# Altium schematic sheet AD637.SchDoc
size A4
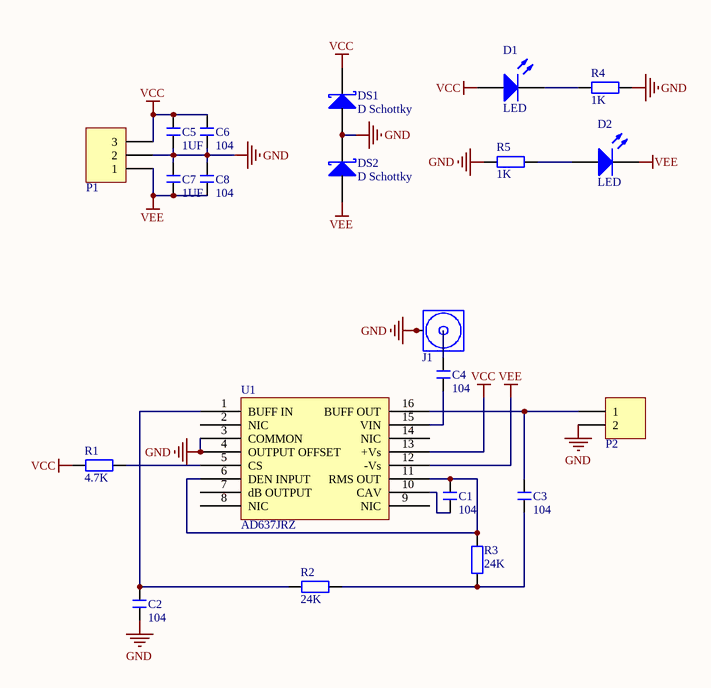
[diagram p0: AD637.SchDoc]

## Parts
C1  104  [C 0805]
C2  104  [C 1206]
C3  104  [C 1206]
C4  104  [C 0805]
C5  1UF  [C 0805]
C6  104  [C 0805]
C7  1UF  [C 0805]
C8  104  [C 0805]
D1  LED  [LED_0805]
D2  LED  [LED_0805]
DS1  D Schottky  [DIODE-SMA]
DS2  D Schottky  [DIODE-SMA]
J1  COAX  [MCX5.08-5-H]  (value not drawn)
P1  Header 3  [HDR3X1_B2]  (value not drawn)
P2  Header 2  [HDR2X1_B2]  (value not drawn)
R1  4.7K  [R 0603]
R2  24K  [R 0603]
R3  24K  [R 0603]
R4  1K  [R 0805]
R5  1K  [R 0805]
U1  AD637JRZ  [RW_16_M]

## Nets
GND: C2.2 C5.2 C6.2 C7.1 C8.1 DS1.1 DS2.2 J1.2(GND) J1.3(GND) J1.4(GND) J1.5(GND) P1.2 P2.2 R4.2 R5.1 U1.3(COMMON) U1.4(OUTPUT_OFFSET)
VCC: C5.1 C6.1 D1.1(A) DS1.2 P1.3 R1.1 U1.13(+Vs)
VEE: C7.2 C8.2 D2.2(K) DS2.1 P1.1 U1.12(-Vs)
NetC1_1: C1.1 U1.10(CAV)
NetC1_2: C1.2 R3.2 U1.6(DEN_INPUT) U1.11(RMS_OUT)
NetC2_1: C2.1 R2.1 U1.1(BUFF_IN)
NetC3_1: C3.1 P2.1 U1.16(BUFF_OUT)
NetC3_2: C3.2 R2.2 R3.1
NetC4_1: C4.1 J1.1(Signal)
NetC4_2: C4.2 U1.15(VIN)
NetD1_2: D1.2(K) R4.1
NetD2_1: D2.1(A) R5.2
NetR1_2: R1.2 U1.5(CS)

Not connected (* = marked no-connect by the designer): U1 2(NIC) 7(dB_OUTPUT) 8(NIC) 9(NIC) 14(NIC)

## Library data of the parts
C1-C8 = C: 无极性贴片电容; 版权归属: 源创客; BOM名称: 无极性贴片电容; 学习资源: www.ooocke.com
D1 D2 = LED: 发光二极管; Published: 8-Jun-2000; LatestRevisionDate: 08-Jul-2005; LatestRevisionNote: Mech Layer 1 removed.; PackageReference: LED; Publisher: Altium Limited
DS1 DS2 = D Schottky: Schottky Diode; Published: 8-Jun-2000; LatestRevisionDate: 17-Jul-2002; LatestRevisionNote: Re-released for DXP Platform.; PackageReference: SMB; Publisher: Altium Limited; PackageDescription: DO-214-AA/SMB; 2 C-Bend Leads; Body 5.3 x 3.6 mm, inc. leads (LxW); Code_JEDEC: DO-214-AA
P1 = Header 3: 接插件; LatestRevisionDate: 17-Jul-2002; LatestRevisionNote: Re-released for DXP Platform.; Publisher: Altium Limited
P2 = Header 2: 接插件; LatestRevisionDate: 17-Jul-2002; LatestRevisionNote: Re-released for DXP Platform.; Publisher: Altium Limited
R1-R5 = R: 贴片电阻; 版权归属: 源创客; BOM名称: 贴片电阻; 学习资源: www.ooocke.com
U1 = AD637JRZ: High Precision, Wideband,RMS-to-DC Converter